# Altium schematic sheet Analog_Telem.SchDoc
size A
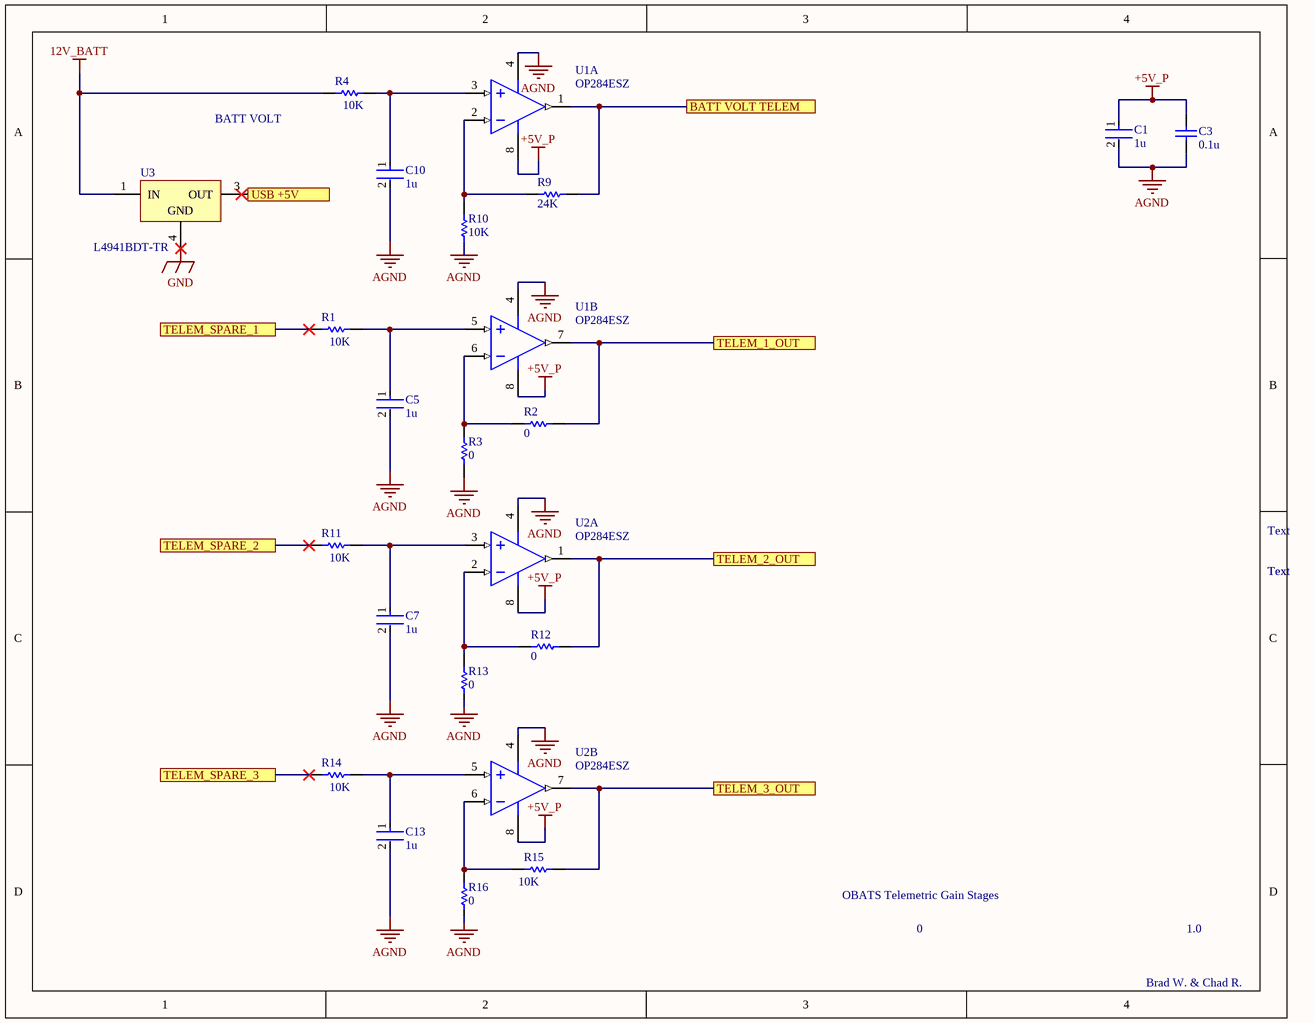
[diagram p0: Analog_Telem.SchDoc]

## Parts
C1  1u  [FP-CL31-IPC_B]
C3  0.1u  [CAPC1206(3216)130_M]
C5  1u  [FP-CL31-IPC_B]
C7  1u  [FP-CL31-IPC_B]
C10  1u  [FP-CL31-IPC_B]
C13  1u  [FP-CL31-IPC_B]
R1  10K  [RESC3116X65X45ML10T20]
R2  0  [RESC3116X65X45ML10T20]
R3  0  [RESC3116X65X45ML10T20]
R4  10K  [RESC3116X65X45ML10T20]
R9  24K  [RESC2013X70X40ML20T20]
R10  10K  [RESC3116X65X45ML10T20]
R11  10K  [RESC3116X65X45ML10T20]
R12  0  [RESC3116X65X45ML10T20]
R13  0  [RESC3116X65X45ML10T20]
R14  10K  [RESC3116X65X45ML10T20]
R15  10K  [RESC3116X65X45ML10T20]
R16  0  [RESC3116X65X45ML10T20]
U1  OP284ESZ  [ADI-R-8_L]  (parts A,B of 2)
U2  OP284ESZ  [ADI-R-8_L]  (parts A,B of 2)
U3  L4941BDT-TR  [TO-252_L]

## Ports
BATT VOLT TELEM, TELEM_1_OUT, TELEM_2_OUT, TELEM_3_OUT, TELEM_SPARE_1, TELEM_SPARE_2, TELEM_SPARE_3, USB +5V

## Nets
12V_BATT: R4.1 U3.1(IN)
+5V_P: C1.1 C3.2 U1.8(+V) U2.8(+V)
AGND: C1.2 C3.1 C5.2 C7.2 C10.2 C13.2 R3.1 R10.1 R13.1 R16.1 U1.4(-V) U2.4(-V)
GND: U3.4(GND)
BATT VOLT TELEM: R9.2 U1.1(OUT_A) ; port BATT VOLT TELEM
TELEM_1_OUT: R2.1 U1.7(OUT_B) ; port TELEM_1_OUT
TELEM_2_OUT: R12.1 U2.1(OUT_A) ; port TELEM_2_OUT
TELEM_3_OUT: R15.1 U2.7(OUT_B) ; port TELEM_3_OUT
TELEM_SPARE_1: R1.1 ; port TELEM_SPARE_1
TELEM_SPARE_2: R11.1 ; port TELEM_SPARE_2
TELEM_SPARE_3: R14.1 ; port TELEM_SPARE_3
USB +5V: U3.3(OUT) ; port USB +5V
NetC5_1: C5.1 R1.2 U1.5(+IN_B)
NetC7_1: C7.1 R11.2 U2.3(+IN_A)
NetC10_1: C10.1 R4.2 U1.3(+IN_A)
NetC13_1: C13.1 R14.2 U2.5(+IN_B)
NetR2_2: R2.2 R3.2 U1.6(-IN_B)
NetR9_1: R9.1 R10.2 U1.2(-IN_A)
NetR12_2: R12.2 R13.2 U2.2(-IN_A)
NetR15_2: R15.2 R16.2 U2.6(-IN_B)

## Notes on the sheet
- BATT VOLT
- Text
- OBATS Telemetric Gain Stages
- 0
- 1.0
- Brad W. & Chad R.

## Library data of the parts
C1 C5 C7 C10 C13 = CMP-13271-001662-1: Cap Ceramic 1uF 50V X7R ±10% SMD 1206 +125°C Embossed T/R; Case Code (Metric): 3216; Packaging: Tape and Reel; Depth: 1.6mm; Max Operating Temperature: 125°C; Length: 3.2mm; Contact Plating: Tin; Voltage Rating (DC): 50V; Radiation Hardening: No; Min Operating Temperature: -55°C; Dielectric: X7R; Voltage: 50V; Lead Free: Lead Free; Capacitance: 1uF; Package Quantity: 1; Material: Ceramic; Thickness: 0.071inch; Width: 0.063inch; Voltage Rating: 50V; Case Code (Imperial): 1206; Mount: Surface Mount; Case/Package: 1206; Tolerance: 10%; Height: 1.6mm
C3 = CMP-1037-04215-1: CAP 100nF 100V ±20% 1206 (3216 Metric) Thickness 1.3mm SMD; Case-EIA: 1206; Tolerance: Â±20%; Case-Metric: 3216; Rated Voltage: 100 V; Max Thickness: 1.3 mm; Technology: SMT; Value: 100nF
R1-R4 R10-R16 = CMP-2003-04910-1: Manufacturer: Yageo; Part Number: AC1206FR-0710KL
R9 = CMP-2001-00525-1: Manufacturer: Panasonic; Part Number: ERJ6ENF2402V
U1 U2 = CMP-0384-00701-1: Double Channel Single-Supply Operation Operational Amplifier, 4.25 MHz BW, 4 V/us SR, Industrial, 8-pin SOIC (R-8), Tube; Generic Part Number: OP284; Manufacturer: Analog Devices; Slew Rate: 4V/us; Amplifiers Per Package: 2; Input Offset Voltage: 175uV; V Span Max: 36V; Iq/Amp: 2mA; V Span Min: 3V; Input Bias Current: 80nA; ComponentLink1URL: http://www.analog.com/en/index.html; PackageReference: R-8; Code_JEDEC: MS-012-AA; Small Signal Bandwidth: 4.25MHz; DatasheetVersion: Rev. J; PackageDescription: 8-Pin Standard Small Outline Package, Body 3.9 x 4.9 mm, Pitch 1.27 mm; ComponentLink3Description: Package Specification; PackageVersion: 060506-A; ComponentLink2Description: Datasheet; ComponentLink3URL: http://www.analog.com/static/imported-files/packages/PKG_PDF/SOIC_Narrow%20(R)/R_8.pdf; Mounting Technology: Surface Mount; ComponentLink2URL: http://www.analog.com/static/imported-files/data_sheets/OP184_284_484.pdf; PartNumber: OP284ESZ; ComponentLink1Description: Manufacturer URL
U3 = CMP-0244-00200-1: 1A Very Low Drop Regulator, 3-Pin DPAK, Tape and Reel; PackageDescription: 3-Pin Transistor Outline Package 2.28 mm Pitch, 9.7 mm Lead Span (DPAK); ComponentLink2URL: http://www.st.com/internet/com/TECHNICAL_RESOURCES/TECHNICAL_LITERATURE/DATASHEET/CD00000443.pdf; ComponentLink1URL: http://www.st.com; DatasheetVersion: 15/09/2006; PackageReference: TO-252; PackageVersion: 2011; ComponentLink2Description: Datasheet; ComponentLink1Description: Manufacturer URL